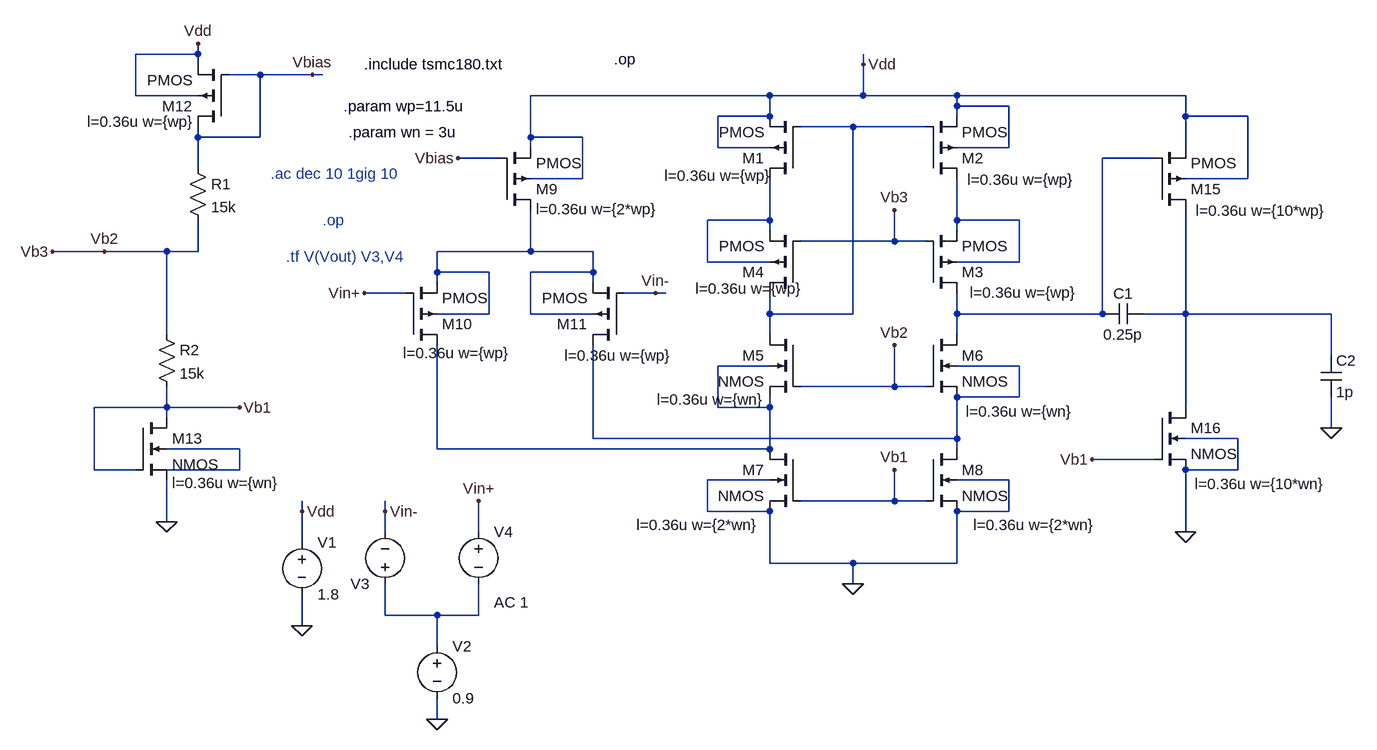
[diagram p0: schematic folded_cacode_11oct.asc]
folded_cacode_11oct.asc, the LTspice schematic file:
Version 4
SHEET 1 1088 980
WIRE -768 -64 -768 -80
WIRE -768 -64 -864 -64
WIRE -768 -48 -768 -64
WIRE 256 -48 256 -64
WIRE -672 -32 -720 -32
WIRE -592 -32 -672 -32
WIRE -576 -32 -592 -32
WIRE -864 0 -864 -64
WIRE -768 0 -864 0
WIRE 112 0 -256 0
WIRE 256 0 256 -48
WIRE 256 0 112 0
WIRE 400 0 256 0
WIRE 752 0 400 0
WIRE 400 16 400 0
WIRE 480 16 400 16
WIRE 112 32 112 0
WIRE 112 32 32 32
WIRE 400 32 400 16
WIRE 752 32 752 0
WIRE 848 32 752 32
WIRE 240 48 160 48
WIRE 352 48 240 48
WIRE -768 64 -768 48
WIRE -672 64 -672 -32
WIRE -672 64 -768 64
WIRE -256 64 -256 0
WIRE -176 64 -256 64
WIRE -256 80 -256 64
WIRE 32 80 32 32
WIRE 112 80 32 80
WIRE 480 80 480 16
WIRE 480 80 400 80
WIRE 752 80 752 32
WIRE -304 96 -368 96
WIRE 704 96 624 96
WIRE -768 112 -768 64
WIRE -176 128 -176 64
WIRE -176 128 -256 128
WIRE 848 128 848 32
WIRE 848 128 752 128
WIRE 112 192 112 128
WIRE 112 192 16 192
WIRE 400 192 400 128
WIRE 496 192 400 192
WIRE 112 208 112 192
WIRE 400 208 400 192
WIRE 304 224 304 176
WIRE 304 224 160 224
WIRE 352 224 304 224
WIRE -912 240 -992 240
WIRE -816 240 -912 240
WIRE -768 240 -768 192
WIRE -768 240 -816 240
WIRE -256 240 -256 176
WIRE -256 240 -400 240
WIRE -160 240 -256 240
WIRE 16 256 16 192
WIRE 112 256 16 256
WIRE 496 256 496 192
WIRE 496 256 400 256
WIRE -400 272 -400 240
WIRE -320 272 -400 272
WIRE -160 272 -160 240
WIRE -160 272 -256 272
WIRE -400 288 -400 272
WIRE -160 288 -160 272
WIRE -448 304 -512 304
WIRE -64 304 -112 304
WIRE -48 304 -64 304
WIRE -320 336 -320 272
WIRE -320 336 -400 336
WIRE -256 336 -256 272
WIRE -160 336 -256 336
WIRE 112 336 112 304
WIRE 240 336 240 48
WIRE 240 336 112 336
WIRE 400 336 400 304
WIRE 624 336 624 96
WIRE 624 336 400 336
WIRE 752 336 752 176
WIRE 752 336 688 336
WIRE 976 336 752 336
WIRE -816 368 -816 240
WIRE 112 368 112 336
WIRE 400 368 400 336
WIRE 976 400 976 336
WIRE 112 416 32 416
WIRE 496 416 400 416
WIRE 304 448 304 384
WIRE 304 448 160 448
WIRE 352 448 304 448
WIRE 496 464 496 416
WIRE 496 464 400 464
WIRE -816 480 -816 448
WIRE -816 480 -928 480
WIRE -704 480 -816 480
WIRE 32 480 32 416
WIRE 112 480 112 464
WIRE 112 480 32 480
WIRE 752 480 752 336
WIRE -816 496 -816 480
WIRE 976 512 976 464
WIRE -160 528 -160 384
WIRE 400 528 400 464
WIRE 400 528 -160 528
WIRE 832 528 752 528
WIRE -704 544 -816 544
WIRE -400 544 -400 384
WIRE 112 544 112 480
WIRE 112 544 -400 544
WIRE 400 544 400 528
WIRE 704 560 608 560
WIRE -928 576 -928 480
WIRE -864 576 -928 576
WIRE -704 576 -704 544
WIRE -704 576 -816 576
WIRE 832 576 832 528
WIRE 832 576 752 576
WIRE 112 592 16 592
WIRE 480 592 400 592
WIRE 304 624 304 576
WIRE 304 624 160 624
WIRE 352 624 304 624
WIRE -608 640 -608 624
WIRE -480 640 -480 624
WIRE 16 640 16 592
WIRE 112 640 16 640
WIRE 480 640 480 592
WIRE 480 640 400 640
WIRE -816 656 -816 592
WIRE -480 672 -480 640
WIRE -336 672 -336 624
WIRE 752 672 752 576
WIRE -608 688 -608 640
WIRE 112 720 112 640
WIRE 240 720 112 720
WIRE 400 720 400 640
WIRE 400 720 240 720
WIRE 240 752 240 720
WIRE -480 800 -480 752
WIRE -400 800 -480 800
WIRE -336 800 -336 752
WIRE -336 800 -400 800
WIRE -608 816 -608 768
WIRE -400 848 -400 800
WIRE -400 960 -400 928
FLAG 240 752 0
FLAG 256 -48 Vdd
FLAG -368 96 Vbias
FLAG -608 816 0
FLAG -608 640 Vdd
FLAG -336 624 Vin+
FLAG -480 640 Vin-
FLAG -768 -80 Vdd
FLAG -592 -32 Vbias
FLAG -816 656 0
FLAG -704 480 Vb1
FLAG -512 304 Vin+
FLAG -64 304 Vin-
FLAG 304 384 Vb2
FLAG 304 176 Vb3
FLAG 304 576 Vb1
FLAG -400 960 0
FLAG 608 560 Vb1
FLAG 752 672 0
FLAG 976 512 0
FLAG -912 240 Vb2
FLAG -992 240 Vb3
DATAFLAG 400 336 ""
DATAFLAG 112 192 ""
DATAFLAG 240 48 ""
DATAFLAG 320 224 ""
DATAFLAG 304 448 ""
DATAFLAG 288 624 ""
DATAFLAG -256 240 ""
DATAFLAG 400 528 ""
DATAFLAG -784 480 ""
DATAFLAG 752 336 ""
DATAFLAG -320 96 ""
DATAFLAG -320 96 ""
DATAFLAG -320 96 ""
DATAFLAG -320 96 ""
DATAFLAG -320 96 ""
DATAFLAG -320 96 ""
DATAFLAG -320 96 ""
DATAFLAG -320 96 ""
DATAFLAG -320 96 ""
DATAFLAG -320 96 ""
DATAFLAG -320 96 ""
DATAFLAG -320 96 ""
DATAFLAG -320 96 ""
DATAFLAG 128 336 ""
DATAFLAG -640 -32 ""
DATAFLAG -816 240 ""
SYMBOL pmos4 160 128 R180
WINDOW 123 44 5 Left 2
SYMATTR Value2 l=0.36u w={wp}
SYMATTR InstName M1
SYMBOL pmos4 352 128 M180
WINDOW 123 64 -1 Left 2
SYMATTR Value2 l=0.36u w={wp}
SYMATTR InstName M2
SYMBOL pmos4 352 304 M180
WINDOW 123 68 1 Left 2
SYMATTR Value2 l=0.36u w={wp}
SYMATTR InstName M3
SYMBOL pmos4 160 304 R180
WINDOW 123 -3 7 Left 2
SYMATTR Value2 l=0.36u w={wp}
SYMATTR InstName M4
SYMBOL nmos4 160 368 M0
WINDOW 123 56 100 Left 2
SYMATTR Value2 l=0.36u w={wn}
SYMATTR InstName M5
SYMBOL nmos4 352 368 R0
WINDOW 123 62 118 Left 2
SYMATTR Value2 l=0.36u w={wn}
SYMATTR InstName M6
SYMBOL nmos4 160 544 M0
WINDOW 123 65 117 Left 2
SYMATTR Value2 l=0.36u w={2*wn}
SYMATTR InstName M7
SYMBOL nmos4 352 544 R0
WINDOW 123 73 117 Left 2
SYMATTR Value2 l=0.36u w={2*wn}
SYMATTR InstName M8
SYMBOL pmos4 -304 176 M180
WINDOW 123 56 1 Left 2
SYMATTR Value2 l=0.36u w={2*wp}
SYMATTR InstName M9
SYMBOL voltage -608 672 R0
WINDOW 123 0 0 Left 0
WINDOW 39 0 0 Left 0
SYMATTR InstName V1
SYMATTR Value 1.8
SYMBOL voltage -480 768 R180
WINDOW 123 24 124 Left 2
WINDOW 39 0 0 Left 0
SYMATTR InstName V3
SYMATTR Value ""
SYMBOL voltage -336 656 R0
WINDOW 123 24 124 Left 2
WINDOW 39 0 0 Left 0
SYMATTR Value2 AC 1
SYMATTR InstName V4
SYMATTR Value ""
SYMBOL pmos4 -720 48 R180
WINDOW 123 53 8 Left 2
SYMATTR Value2 l=0.36u w={wp}
SYMATTR InstName M12
SYMBOL res -784 96 R0
SYMATTR InstName R1
SYMATTR Value 15k
SYMBOL pmos4 -112 384 R180
WINDOW 123 -74 -16 Left 2
SYMATTR Value2 l=0.36u w={wp}
SYMATTR InstName M11
SYMBOL pmos4 -448 384 M180
WINDOW 123 -4 -12 Left 2
SYMATTR Value2 l=0.36u w={wp}
SYMATTR InstName M10
SYMBOL nmos4 -864 496 R0
WINDOW 123 56 100 Left 2
SYMATTR Value2 l=0.36u w={wn}
SYMATTR InstName M13
SYMBOL res -832 352 R0
SYMATTR InstName R2
SYMATTR Value 15k
SYMBOL voltage -400 832 R0
WINDOW 123 0 0 Left 0
WINDOW 39 0 0 Left 0
SYMATTR InstName V2
SYMATTR Value 0.9
SYMBOL cap 688 320 R90
WINDOW 0 0 32 VBottom 2
WINDOW 3 32 32 VTop 2
SYMATTR InstName C1
SYMATTR Value 0.25p
SYMBOL pmos4 704 176 M180
WINDOW 123 64 -1 Left 2
SYMATTR Value2 l=0.36u w={10*wp}
SYMATTR InstName M15
SYMBOL nmos4 704 480 R0
WINDOW 123 62 118 Left 2
SYMATTR Value2 l=0.36u w={10*wn}
SYMATTR InstName M16
SYMBOL cap 960 400 R0
SYMATTR InstName C2
SYMATTR Value 1p
TEXT -512 -48 Left 2 !.include tsmc180.txt
TEXT -544 16 Left 2 !.param wp=11.5u
TEXT -536 56 Left 2 !.param wn = 3u
TEXT -128 -56 Left 2 !.op
TEXT -656 120 Left 2 ;.ac dec 10 1gig 10
TEXT -576 192 Left 2 ;.op
TEXT -632 248 Left 2 ;.tf V(Vout) V3,V4

The netlist it stands for:
* folded_cacode_11oct.asc
M1 N003 N001 Vdd Vdd PMOS l=0.36u w={wp}
M2 N004 N001 Vdd Vdd PMOS l=0.36u w={wp}
M3 N002 Vb3 N004 N004 PMOS l=0.36u w={wp}
M4 N001 Vb3 N003 N003 PMOS l=0.36u w={wp}
M5 N001 Vb3 N007 N007 NMOS l=0.36u w={wn}
M6 N002 Vb3 N008 N008 NMOS l=0.36u w={wn}
M7 N007 Vb1 0 0 NMOS l=0.36u w={2*wn}
M8 N008 Vb1 0 0 NMOS l=0.36u w={2*wn}
M9 N005 Vbias Vdd Vdd PMOS l=0.36u w={2*wp}
V1 Vdd 0 1.8
V3 N010 Vin-
V4 Vin+ N010 AC 1
M12 Vbias Vbias Vdd Vdd PMOS l=0.36u w={wp}
R1 Vbias Vb3 15k
M11 N008 Vin- N005 N005 PMOS l=0.36u w={wp}
M10 N007 Vin+ N005 N005 PMOS l=0.36u w={wp}
M13 Vb1 Vb1 0 N009 NMOS l=0.36u w={wn}
R2 Vb3 Vb1 15k
V2 N010 0 0.9
C1 N006 N002 0.25p
M15 N006 N002 Vdd Vdd PMOS l=0.36u w={10*wp}
M16 N006 Vb1 0 0 NMOS l=0.36u w={10*wn}
C2 N006 0 1p
.model NMOS NMOS
.model PMOS PMOS
.lib standard.mos
.include tsmc180.txt
.param wp=11.5u
.param wn = 3u
.op
* .ac dec 10 1gig 10
* .op
* .tf V(Vout) V3,V4
.backanno
.end